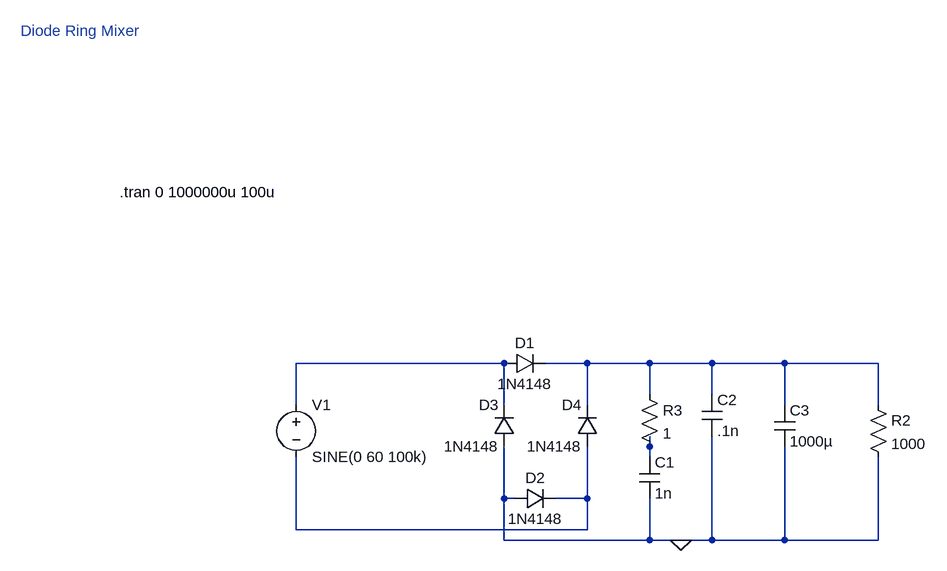
[diagram p0: schematic FullBridge.asc]
FullBridge.asc, the LTspice schematic file:
Version 4
SHEET 1 1688 800
WIRE 560 96 240 96
WIRE 688 96 624 96
WIRE 784 96 688 96
WIRE 880 96 784 96
WIRE 992 96 880 96
WIRE 1136 96 992 96
WIRE 784 144 784 96
WIRE 880 144 880 96
WIRE 240 160 240 96
WIRE 560 160 560 96
WIRE 688 160 688 96
WIRE 992 160 992 96
WIRE 1136 160 1136 96
WIRE 784 224 784 208
WIRE 784 240 784 224
WIRE 560 304 560 224
WIRE 576 304 560 304
WIRE 688 304 688 224
WIRE 688 304 640 304
WIRE 240 352 240 240
WIRE 688 352 688 304
WIRE 688 352 240 352
WIRE 560 368 560 304
WIRE 784 368 784 304
WIRE 784 368 560 368
WIRE 832 368 784 368
WIRE 880 368 880 208
WIRE 880 368 832 368
WIRE 992 368 992 224
WIRE 992 368 880 368
WIRE 1136 368 1136 240
WIRE 1136 368 992 368
FLAG 832 368 0
SYMBOL diode 560 112 R270
WINDOW 0 32 32 VTop 2
WINDOW 3 0 32 VBottom 2
SYMATTR InstName D1
SYMATTR Value 1N4148
SYMBOL diode 576 320 R270
WINDOW 0 32 32 VTop 2
WINDOW 3 0 32 VBottom 2
SYMATTR InstName D2
SYMATTR Value 1N4148
SYMBOL diode 576 224 R180
WINDOW 0 24 64 Left 2
WINDOW 3 24 0 Left 2
SYMATTR InstName D3
SYMATTR Value 1N4148
SYMBOL diode 704 224 R180
WINDOW 0 24 64 Left 2
WINDOW 3 24 0 Left 2
SYMATTR InstName D4
SYMATTR Value 1N4148
SYMBOL voltage 240 144 R0
SYMATTR InstName V1
SYMATTR Value SINE(0 60 100k)
SYMATTR Value2 AC 5
SYMBOL res 1120 144 R0
SYMATTR InstName R2
SYMATTR Value 1000
SYMBOL cap 976 160 R0
SYMATTR InstName C3
SYMATTR Value 1000µ
SYMATTR SpiceLine Rser=0.001
SYMBOL res 768 128 R0
SYMATTR InstName R3
SYMATTR Value 1
SYMBOL cap 768 240 R0
SYMATTR InstName C1
SYMATTR Value 1n
SYMATTR SpiceLine Rser=.001
SYMBOL cap 864 144 R0
SYMATTR InstName C2
SYMATTR Value .1n
SYMATTR SpiceLine Rser=.001
TEXT -184 -416 Left 2 ;Diode Ring Mixer
TEXT -32 -168 Left 2 !.tran 0 1000000u 100u

The netlist it stands for:
* FullBridge.asc
D1 N001 N002 1N4148
D2 0 N004 1N4148
D3 0 N001 1N4148
D4 N004 N002 1N4148
V1 N001 N004 SINE(0 60 100k) AC 5
R2 N002 0 1000
C3 N002 0 1000µ Rser=0.001
R3 N002 N003 1
C1 N003 0 1n Rser=.001
C2 N002 0 .1n Rser=.001
.model D D
.lib standard.dio
* Diode Ring Mixer
.tran 0 1000000u 100u
.backanno
.end